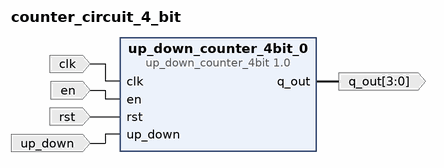
[diagram p0: block diagram of the top level]
# Vivado block design counter_circuit_4_bit, xc7a100tcsg324-1, Vivado 2025.1
create_bd_design counter_circuit_4_bit

create_bd_port -dir O -from 3 -to 0 q_out
create_bd_port -dir I -type clk clk
set_property -dict {CONFIG.FREQ_HZ 100000000} [get_bd_ports clk]
create_bd_port -dir I -type rst rst
create_bd_port -dir I en
create_bd_port -dir I up_down

create_bd_cell -type ip -vlnv xilinx.com:user:up_down_counter_4bit:1.0 up_down_counter_4bit_0

# ---- connections ----

connect_bd_net [get_bd_ports clk] [get_bd_pins up_down_counter_4bit_0/clk]
connect_bd_net [get_bd_ports en] [get_bd_pins up_down_counter_4bit_0/en]
connect_bd_net [get_bd_ports rst] [get_bd_pins up_down_counter_4bit_0/rst]
connect_bd_net [get_bd_ports up_down] [get_bd_pins up_down_counter_4bit_0/up_down]
connect_bd_net [get_bd_pins up_down_counter_4bit_0/q_out] [get_bd_ports q_out]

validate_bd_design
save_bd_design
